# EAGLE design LightWand_USB_power (EAGLE 8.7.0)
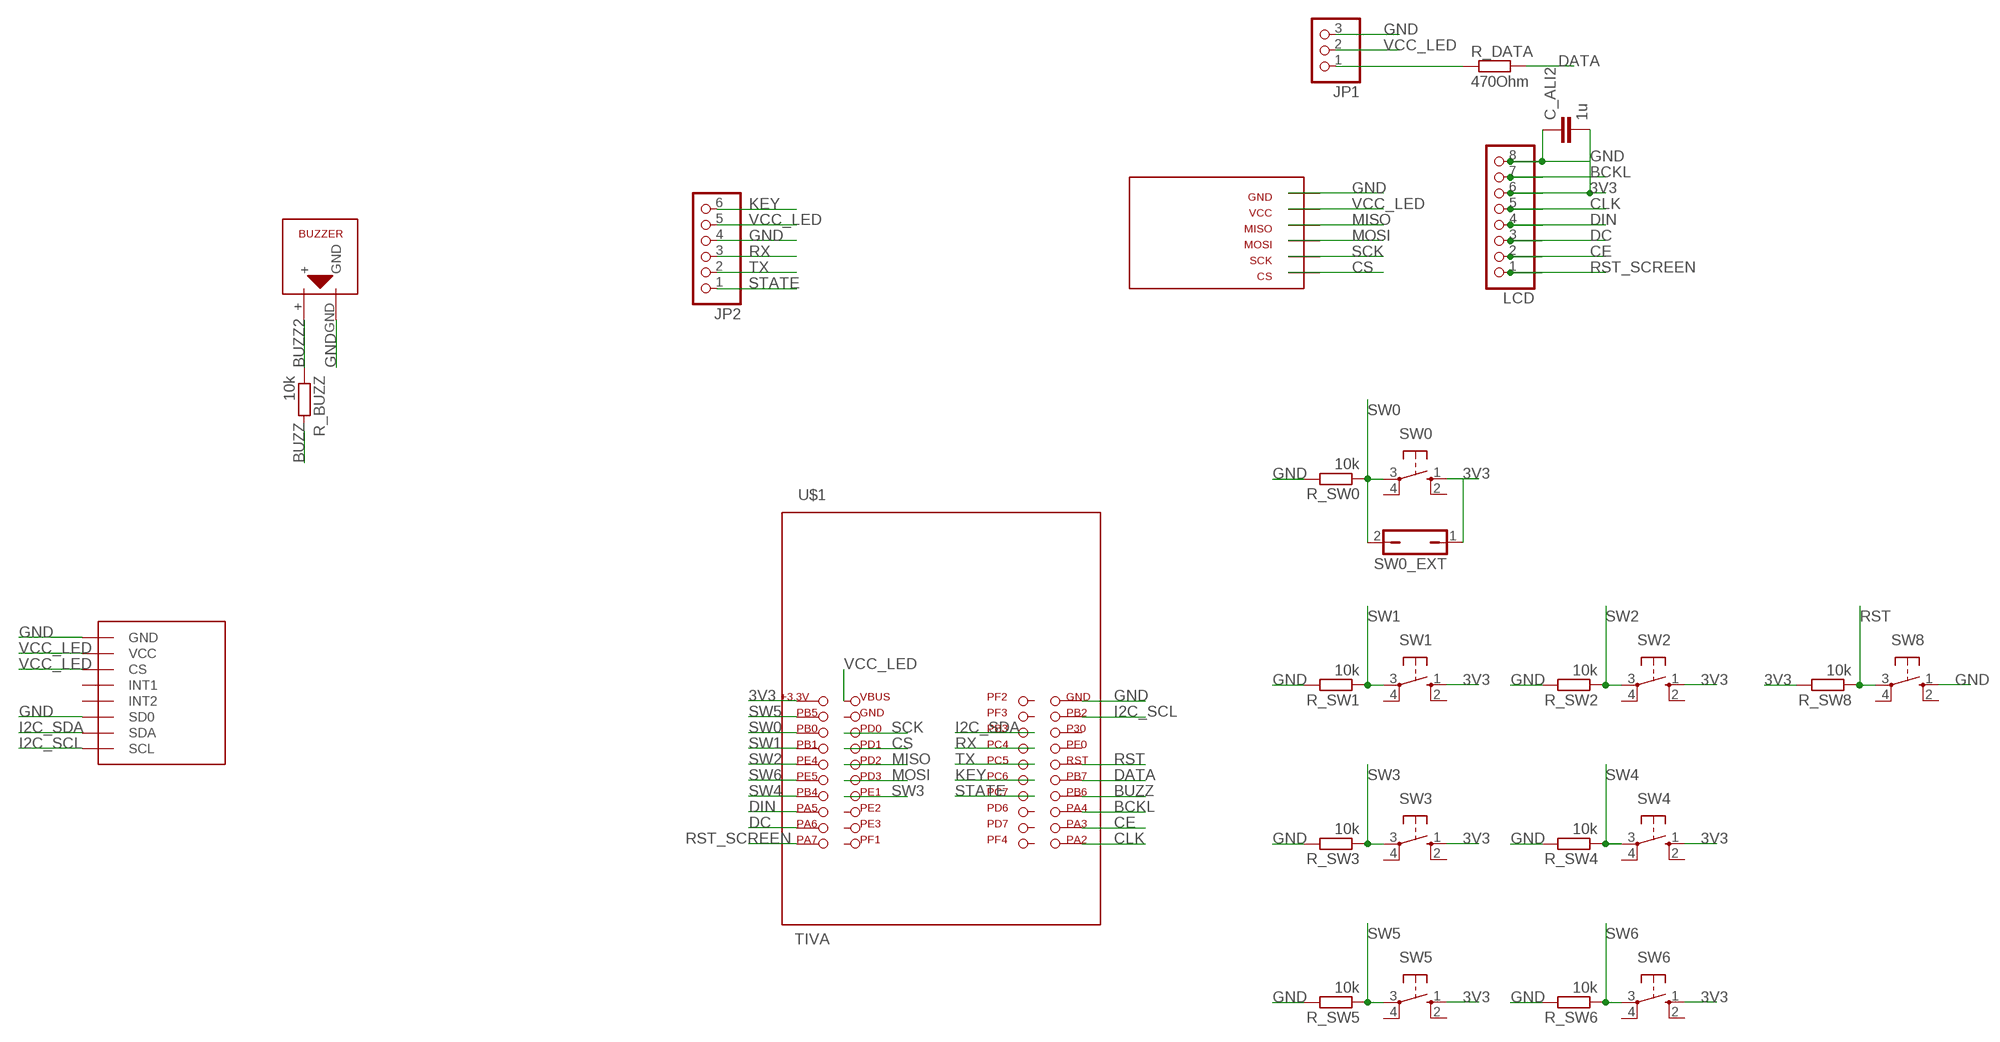
[diagram p0: schematic, sheet 1]

## Parts
C_ALI2  1u  C-EUC1206  [C1206]
JP1  PINHD-1X3  [1X03]
JP2  PINHD-1X6  [1X06]
LCD  PINHD-1X8  [1X08]
R_BUZZ  10k  R-EU_R1206  [R1206]
R_DATA  470Ohm  R-EU_R1206  [R1206]
R_SW0  10k  R-EU_R1206  [R1206]
R_SW1  10k  R-EU_R1206  [R1206]
R_SW2  10k  R-EU_R1206  [R1206]
R_SW3  10k  R-EU_R1206  [R1206]
R_SW4  10k  R-EU_R1206  [R1206]
R_SW5  10k  R-EU_R1206  [R1206]
R_SW6  10k  R-EU_R1206  [R1206]
R_SW8  10k  R-EU_R1206  [R1206]
SW0  10-XX  [B3F-10XX]
SW0_EXT  JP1Q  [JP1]
SW1  10-XX  [B3F-10XX]
SW2  10-XX  [B3F-10XX]
SW3  10-XX  [B3F-10XX]
SW4  10-XX  [B3F-10XX]
SW5  10-XX  [B3F-10XX]
SW6  10-XX  [B3F-10XX]
SW8  10-XX  [B3F-10XX]
U$1  TIVA  [TIVACSERIES]
U$2  ADXL345  [ADXL345]
U$3  MURATA_BUZZER  [MURATA_BUZZER]
U$4  SD_READER_CATALEX  [SD_READER_CATALEX]

## Nets
3V3: C_ALI2.2 LCD.6 R_SW8.2 SW0.1(S) SW0_EXT.1 SW1.1(S) SW2.1(S) SW3.1(S) SW4.1(S) SW5.1(S) SW6.1(S) U$1.+3.3V(3.3V)
BCKL: LCD.7 U$1.PA4
BUZZ: R_BUZZ.2 U$1.PB6
BUZZ2: R_BUZZ.1 U$3.+
CE: LCD.2 U$1.PA3
CLK: LCD.5 U$1.PA2
CS: U$1.PD1 U$4.CS
DATA: R_DATA.2 U$1.PB7
DC: LCD.3 U$1.PA6
DIN: LCD.4 U$1.PA5
GND [GND]: C_ALI2.1 JP1.3 JP2.4 LCD.8 R_SW0.2 R_SW1.2 R_SW2.2 R_SW3.2 R_SW4.2 R_SW5.2 R_SW6.2 SW8.1(S) U$1.GND1(GND2) U$2.P$1(GND) U$2.P$6(SD0) U$3.GND U$4.GND
I2C_SCL: U$1.PB2 U$2.P$7(SCL)
I2C_SDA: U$1.PB3 U$2.P$8(SDA)
KEY: JP2.6 U$1.PC6
MISO: U$1.PD2 U$4.MISO
MOSI: U$1.PD3 U$4.MOSI
N$3: JP1.1 R_DATA.1
RST: R_SW8.1 SW8.3(P) U$1.RST
RST_SCREEN: LCD.1 U$1.PA7
RX: JP2.3 U$1.PC4
SCK: U$1.PD0 U$4.SCK
STATE: JP2.1 U$1.PC7
SW0: R_SW0.1 SW0.3(P) SW0_EXT.2 U$1.PB0
SW1: R_SW1.1 SW1.3(P) U$1.PB1
SW2: R_SW2.1 SW2.3(P) U$1.PE4
SW3: R_SW3.1 SW3.3(P) U$1.PE1
SW4: R_SW4.1 SW4.3(P) U$1.PB4
SW5: R_SW5.1 SW5.3(P) U$1.PB5
SW6: R_SW6.1 SW6.3(P) U$1.PE5
TX: JP2.2 U$1.PC5
VCC_LED [VCC]: JP1.2 JP2.5 U$1.VBUS U$2.P$2(VCC) U$2.P$3(CS) U$4.VCC
Unconnected: SW0.2(S1) SW0.4(P1) SW1.2(S1) SW1.4(P1) SW2.2(S1) SW2.4(P1) SW3.2(S1) SW3.4(P1) SW4.2(S1) SW4.4(P1) SW5.2(S1) SW5.4(P1) SW6.2(S1) SW6.4(P1) SW8.2(S1) SW8.4(P1) U$1.GND U$1.P30 U$1.PD6 U$1.PD7 U$1.PE2 U$1.PE3 U$1.PF0 U$1.PF1 U$1.PF2 U$1.PF3 U$1.PF4 U$2.P$4(INT1) U$2.P$5(INT2)

## Library data of the parts
C_ALI2 = resistor:C-EU: CAPACITOR, European symbol
JP1 = adafruit:PINHD-1X3: PIN HEADER
JP2 = adafruit:PINHD-1X6: PIN HEADER
LCD = pinhead:PINHD-1X8: PIN HEADER
R_BUZZ R_DATA R_SW0 R_SW1-R_SW6 R_SW8 = resistor:R-EU_: RESISTOR, European symbol
SW0 SW1-SW6 SW8 = switch-omron:10-XX: OMRON SWITCH; MPN: B3F-1000; OC_FARNELL: 176432; OC_NEWARK: 36M3542
SW0_EXT = jumper:JP1Q: JUMPER
U$1 = aetel:TIVA
U$2 = aetel:ADXL345: SPI/I2C accelerometer
U$3 = aetel:MURATA_BUZZER: Murata SMD buzzer model PKLCS1212E4001-R1
U$4 = aetel:SD_READER_CATALEX

## Net classes
1 GND: width 1.016 mm
2 VCC: width 0.889 mm
3 VCC_LED: width 0.889 mm
4 VIN: width 1.016 mm

## Board
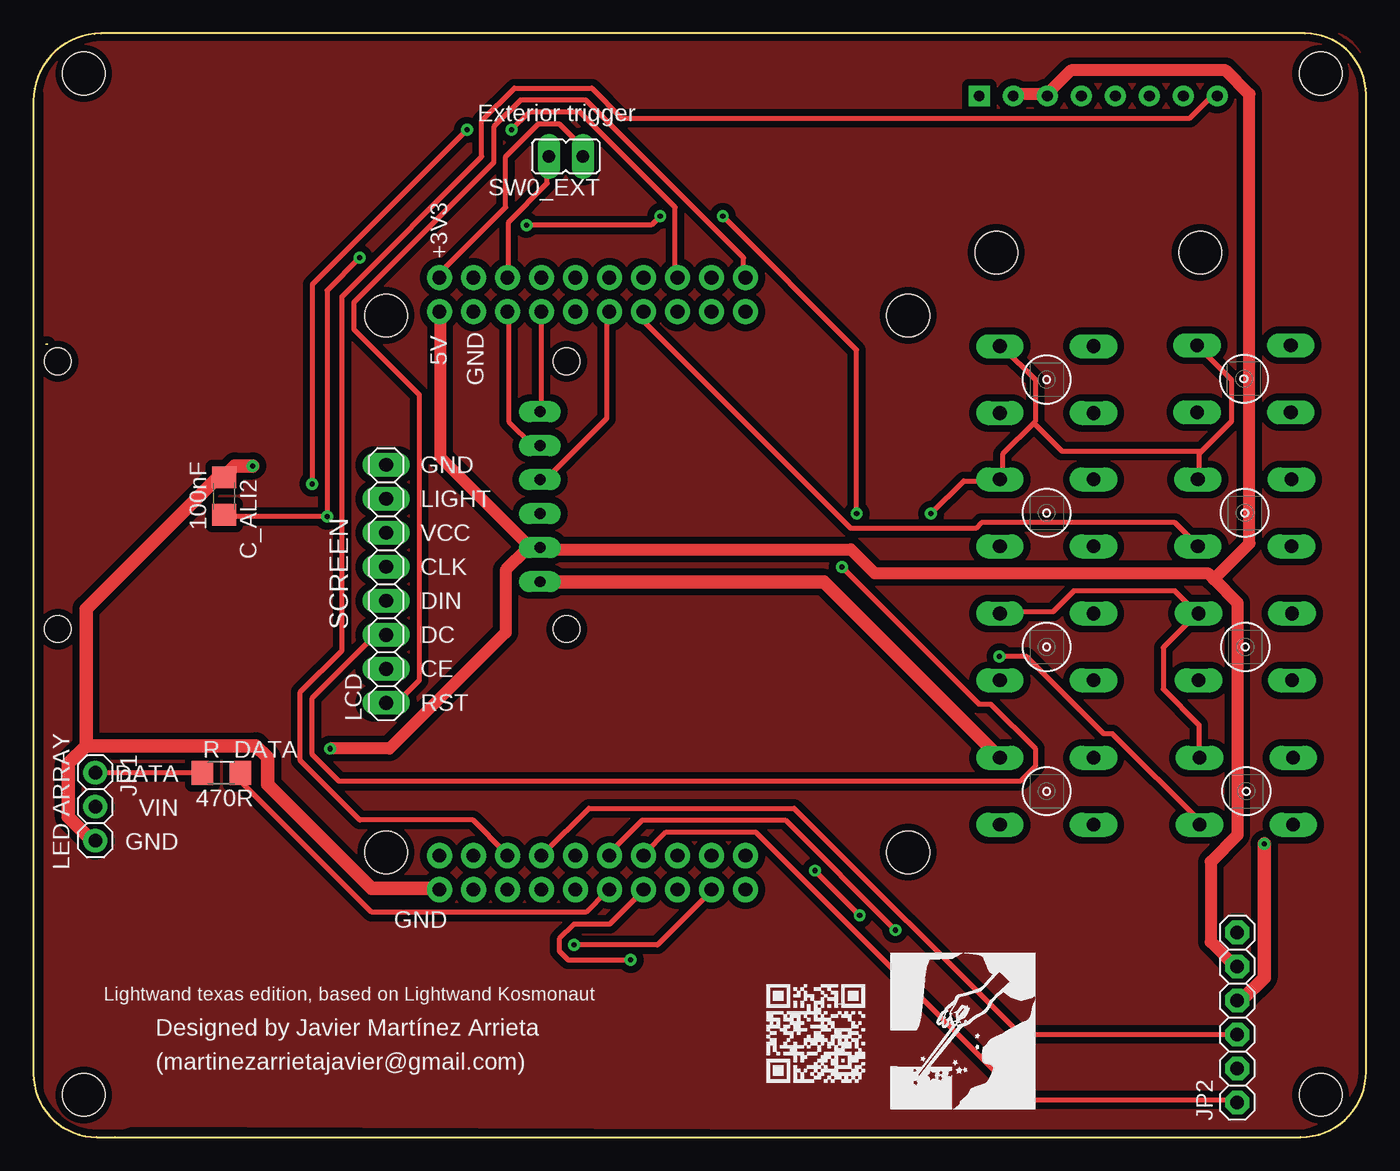
[diagram p1: board, top side]
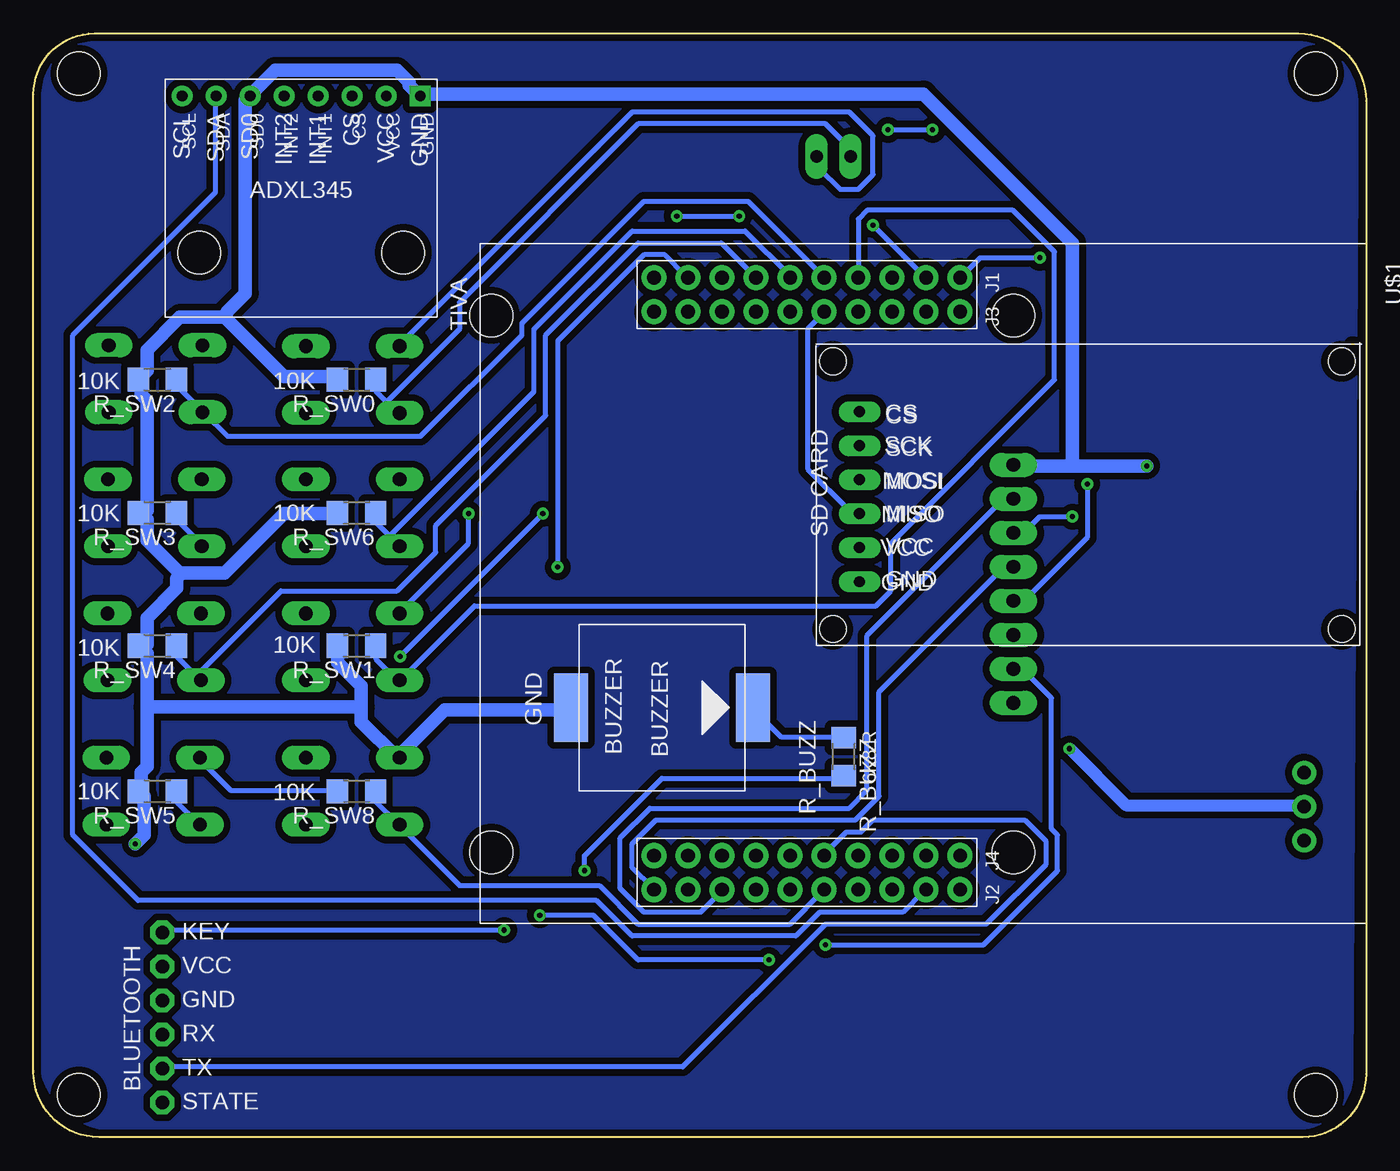
[diagram p2: board, bottom side, seen from below]

Size 99.54 x 82.45 mm. Coordinates in mm from the lower left corner, seen from the top.
Outline: 5.03,82.45 arc90 0,77.42 0,66.75 0,4.72 arc90 4.72,0 6.07,0 94.67,0 arc90 99.54,4.88 99.54,4.98 99.54,77.9 arc90 95,82.45 5.03,82.45
Copper layers (1*16): Top 0.035mm / dielectric 1.5mm / Bottom 0.035mm
Design rules "china": minimum track width 15mil, minimum drill 15mil, track to track 20mil, track to pad 20mil, pad to pad 20mil, via to via 15mil, smd to smd 8mil, copper to edge 20mil, drill to drill 8mil, minimum pad ring 15mil, minimum via ring 10mil, stop-mask expansion 4mil, vias tented up to drill 0mil, thermal gap 10mil
Holes 3.2 mm at 26.34,21.27 26.34,61.38 65.34,61.38 65.34,21.27 3.75,79.46 3.75,3.15 96.15,79.46 96.15,3.15

### Footprints (pad centres in the part's own frame; a part is rotated, then mirrored left to right if it is on the bottom)
C1206 = smd 1.6 x 1.8: 1 -1.4,0; 2 1.4,0
1X03 = drill 1.016: 1 -2.54,0; 2 0,0; 3 2.54,0
1X06 = drill 1.016 octagon: 1 -6.35,0; 2 -3.81,0; 3 -1.27,0; 4 1.27,0; 5 3.81,0; 6 6.35,0
1X08 = drill 1.016 long: 1 -8.89,0; 2 -6.35,0; 3 -3.81,0; 4 -1.27,0; 5 1.27,0; 6 3.81,0; 7 6.35,0; 8 8.89,0
R1206 = smd 1.6 x 1.803: 1 -1.422,0; 2 1.422,0
B3F-10XX = drill 1.016 long: 1 -3.5,2.5; 2 3.5,2.5; 3 -3.5,-2.5; 4 3.5,-2.5
JP1 = drill 0.914 long: 1 0,-1.27; 2 0,1.27
TIVACSERIES = drill 1.016 pad 1.88: +3.3V -22.86,11.43; GND -20.32,8.89; GND1 22.86,11.43; P30 22.86,6.35; PA2 22.86,-11.43; PA3 22.86,-8.89; PA4 22.86,-6.35; PA5 -22.86,-6.35; PA6 -22.86,-8.89; PA7 -22.86,-11.43; PB0 -22.86,6.35; PB1 -22.86,3.81; PB2 22.86,8.89; PB3 20.32,6.35; PB4 -22.86,-3.81; PB5 -22.86,8.89; PB6 22.86,-3.81; PB7 22.86,-1.27; PC4 20.32,3.81; PC5 20.32,1.27; PC6 20.32,-1.27; PC7 20.32,-3.81; PD0 -20.32,6.35; PD1 -20.32,3.81; PD2 -20.32,1.27; PD3 -20.32,-1.27; PD6 20.32,-6.35; PD7 20.32,-8.89; PE1 -20.32,-3.81; PE2 -20.32,-6.35; PE3 -20.32,-8.89; PE4 -22.86,1.27; PE5 -22.86,-1.27; PF0 22.86,3.81; PF1 -20.32,-11.43; PF2 20.32,11.43; PF3 20.32,8.89; PF4 20.32,-11.43; RST 22.86,1.27; VBUS -20.32,11.43
ADXL345 = drill 0.8 square: P$1 -7.62,8.89 | drill 0.8: P$2 -7.62,6.35; P$3 -7.62,3.81; P$4 -7.62,1.27; P$5 -7.62,-1.27; P$6 -7.62,-3.81; P$7 -7.62,-6.35; P$8 -7.62,-8.89 | hole 3.2: 4.08,7.62; 4.08,-7.62
MURATA_BUZZER = smd 5.08 x 2.54: + 0,-6.8; GND 0,6.8
SD_READER_CATALEX = drill 0.8 long: CS -7.187,6.322; GND -7.187,-6.378; MISO -7.187,-1.298; MOSI -7.187,1.242; SCK -7.187,3.782; VCC -7.187,-3.838 | hole 2: -9.187,10.077; -9.187,-9.93; 28.826,10.077; 28.826,-9.93

### Placement (x,y rotation side)
C_ALI2  14.25,47.9 270 top
JP1  4.62,24.69 270 top
JP2  89.92,8.94 90 top
LCD  26.34,41.33 90 top
R_BUZZ  39.01,28.42 270 bottom
R_DATA  14.05,27.21 0 top
R_SW0  75.41,56.59 180 bottom
R_SW1  75.41,36.71 180 bottom
R_SW2  90.29,56.59 180 bottom
R_SW3  90.29,46.63 180 bottom
R_SW4  90.29,36.71 180 bottom
R_SW5  90.29,25.84 180 bottom
R_SW6  75.41,46.63 180 bottom
R_SW8  75.41,25.84 180 bottom
SW0  75.69,56.59 0 top
SW0_EXT  39.77,73.26 90 top
SW1  75.69,36.62 0 top
SW2  90.42,56.65 0 top
SW3  90.48,46.63 0 top
SW4  90.53,36.62 0 top
SW5  90.6,25.84 0 top
SW6  75.69,46.63 0 top
SW8  75.69,25.84 0 top
U$1  41.76,41.35 270 bottom
U$2  79.54,70.16 270 bottom
U$3  52.6,32.08 90 bottom
U$4  30.65,47.88 0 bottom

### Tracks (layer width: path | path; a pad name or v marks a point on that pad's centre or on a via)
3V3  (via drill 0.38)
  Top 0.381: 87.16,51.13 89.5,53.47 89.5,56.58 87.05,59.02 SW2.1 | 87.16,51.13 87.05,51.02 87.05,49.24 SW3.1 | 74.72,53.36 74.83,53.47 74.83,56.58 72.38,59.02 SW0.1 | 74.72,53.36 72.38,51.02 72.38,49.24 SW6.1 72.16,49.02 69.49,49.02 v67.05,46.58 | 87.16,51.13 87.05,51.24 76.83,51.24 74.83,53.24 74.72,53.36 | SW1.1 72.38,39.24 76.16,39.24 77.72,40.8 85.27,40.8 86.83,39.24 SW4.1 86.83,39.02 84.39,36.58 84.39,33.47 87.05,30.8 87.05,28.35 SW5.1 | C_ALI2.2 14.38,46.36 v21.93,46.36 21.93,63.25 v24.38,65.69 | SW0_EXT.1 40.82,73.47 40.82,74.14 39.27,75.69 37.71,75.69 35.27,73.25 35.27,69.47 30.16,64.36 U$1.+3.3V
  Bottom 0.381: R_SW8.2 77.05,25.91 84.83,25.91 87.05,28.13 SW5.1 | v67.05,46.58 67.05,44.36 72.16,39.24 SW1.1 | v21.93,46.36 24.38,46.36 25.49,45.24 26.16,45.24 LCD.6 | v24.38,65.69 28.82,65.69 30.16,64.36 U$1.+3.3V | SW0.1 72.16,59.24 54.83,76.58 38.6,76.58 36.82,74.8 36.82,71.91 37.93,70.8 39.27,70.8 40.82,72.36 40.82,73.25 SW0_EXT.1
BCKL
  Bottom 0.381: LCD.7 26.38,47.47 27.27,47.47 37.27,37.47 37.27,25.91 38.6,24.57 53.49,24.57 55.71,22.35 55.71,18.57 53.94,16.8 49.71,16.8 48.16,18.35 U$1.PA4
BUZZ  (via drill 0.38)
  Top 0.381: v61.72,16.57 v58.38,19.91 | v44.6,13.24 39.94,13.24 39.27,13.91 39.27,14.8 40.38,15.91 43.05,15.91 45.49,18.35 U$1.PB6
  Bottom 0.381: v58.38,19.91 58.38,21.02 52.6,26.8 39.05,26.8 R_BUZZ.2 | v61.72,16.57 57.72,16.57 54.38,13.24 v44.6,13.24
BUZZ2
  Bottom 0.381: R_BUZZ.1 39.05,29.91 43.71,29.91 45.71,31.91 U$3.+
CE  (via drill 0.38)
  Top 0.381: v40.38,14.35 46.6,14.35 50.6,18.35 U$1.PA3
  Bottom 0.381: v40.38,14.35 28.6,14.35 23.04,19.91 23.04,22.57 23.49,23.02 23.49,32.8 25.49,34.8 26.16,34.8 LCD.2
CLK
  Bottom 0.381: LCD.5 26.38,42.58 27.04,42.58 36.38,33.24 36.38,25.46 38.16,23.69 53.05,23.69 54.83,21.91 54.83,20.13 53.27,18.57 U$1.PA2
CS
  Top 0.381: U$4.CS 37.93,54.36 37.93,61.47 U$1.PD1
DATA
  Top 0.381: R_DATA.2 15.49,27.02 15.49,26.57 25.27,16.8 41.27,16.8 42.82,18.35 U$1.PB7
DC  (via drill 0.38)
  Top 0.381: v60.38,42.58 70.61,32.35 71.49,32.35 74.83,29.02 74.83,27.69 73.72,26.57 22.82,26.57 20.82,28.57 20.82,32.8 25.49,37.47 26.16,37.47 LCD.3
  Bottom 0.381: v60.38,42.58 60.38,59.47 53.94,65.91 52.38,65.91 50.83,64.36 U$1.PA6
DIN  (via drill 0.38)
  Top 0.381: v20.82,48.8 20.82,63.69 v32.38,75.25 | v35.71,75.25 37.05,76.58 40.82,76.58 47.94,69.47 47.94,64.36 U$1.PA5
  Bottom 0.381: v20.82,48.8 20.82,44.8 25.49,40.13 26.16,40.13 LCD.4 | v35.71,75.25 v32.38,75.25
GND  (via drill 0.38)
  Top 1.016: 3.93,29.24 3.93,39.47 13.71,49.24 14.15,49.24 C_ALI2.1 14.6,49.69 15.04,50.13 v16.38,50.13 | 3.93,29.24 2.6,27.91 2.6,23.91 4.15,22.35 4.6,22.35 JP1.3 | U$1.GND1 30.16,18.57 25.27,18.57 17.49,26.35 17.49,28.35 16.6,29.24 4.38,29.24 3.93,29.24 | U$4.GND 37.93,41.47 59.05,41.47 72.16,28.35 SW8.1 | v91.94,21.91 91.94,11.91 90.39,10.35 89.94,10.35 JP2.4
  Bottom 1.016: v16.38,50.13 21.93,50.13 | 21.93,50.13 26.16,50.13 LCD.8 | 75.05,32.13 75.05,31.02 72.38,28.35 SW8.1 71.94,28.8 68.83,31.91 59.49,31.91 U$3.GND | 75.05,32.13 75.05,33.69 76.83,35.47 76.83,36.58 R_SW1.2 | 85.27,61.25 80.83,56.8 77.05,56.8 R_SW0.2 | 85.27,61.25 88.61,61.25 91.05,58.8 91.05,57.24 91.5,56.8 R_SW2.2 91.5,56.13 91.5,55.47 91.05,55.02 91.05,46.8 R_SW3.2 91.5,46.58 91.05,46.13 91.05,44.58 88.61,42.13 | 85.27,61.25 85.05,61.69 83.72,63.02 83.72,77.47 U$2.P$6 83.27,77.91 81.5,79.69 72.38,79.69 71.49,78.8 71.49,78.58 70.83,77.91 U$2.P$1 70.16,77.91 33.05,77.91 21.93,66.8 21.93,50.58 21.93,50.13 | 88.61,42.13 85.27,42.13 80.83,46.58 77.05,46.58 R_SW6.2 | 91.05,32.13 91.05,36.13 91.5,36.58 R_SW4.2 91.05,36.8 91.05,38.8 88.83,41.02 88.83,41.69 88.61,42.13 | 91.05,32.13 91.05,27.69 91.5,27.24 91.5,25.91 R_SW5.2 91.28,25.46 91.28,22.57 v91.94,21.91 | 75.05,32.13 75.5,32.13 90.61,32.13 91.05,32.13
I2C_SCL
  Bottom 0.381: U$2.P$7 85.94,77.69 85.94,70.58 96.61,59.91 96.61,22.57 91.72,17.69 57.49,17.69 54.83,15.02 42.6,15.02 40.82,16.8 34.6,16.8 33.05,18.35 U$1.PB2
I2C_SDA
  Top 0.381: U$2.P$8 88.39,77.69 87.94,77.69 86.39,76.14 43.94,76.14 41.71,78.36 35.93,78.36 33.49,75.91 33.49,73.25 23.04,62.8 23.04,36.35 19.93,33.24 19.93,28.13 24.38,23.69 32.82,23.69 35.27,21.24 U$1.PB3
KEY  (via drill 0.38)
  Top 0.381: v64.38,15.46 56.16,23.69 45.49,23.69 43.05,21.24 U$1.PC6
  Bottom 0.381: v64.38,15.46 89.72,15.46 JP2.6
MISO
  Bottom 0.381: U$4.MISO 37.93,46.8 38.6,46.8 41.71,49.91 41.71,60.36 40.6,61.47 U$1.PD2
MOSI
  Top 0.381: U$4.MOSI 37.93,49.24 38.38,49.24 42.82,53.69 42.82,61.47 U$1.PD3
N$1
  pour Bottom: 1.02,4.32 arc90 5.87,0.58 93.68,0.45 arc90 99.19,7.01 99.31,79.2 arc90 95.78,82.31 5.16,82.46 arc90 0.61,78.82
N$2
  pour Top: 4.6,82.42 arc90 0.79,77.88 0.79,3.48 arc90 7.29,0.86 93.75,0.48 arc90 99.24,6.5 99.34,80.52 arc90 95.1,82.46 4.85,82.46
N$3
  Top 0.381: R_DATA.1 12.6,27.24 4.82,27.24 JP1.1
RST
  Bottom 0.381: R_SW8.1 73.94,25.69 73.94,25.02 72.38,23.46 SW8.3 72.16,23.24 67.72,18.8 57.27,18.8 54.38,15.91 43.05,15.91 40.6,18.35 U$1.RST
RST_SCREEN
  Top 0.381: LCD.1 26.38,32.58 27.27,32.58 28.82,34.13 28.82,55.47 23.93,60.36 23.93,62.36 34.38,72.8 34.38,75.47 36.38,77.47 41.27,77.47 53.05,65.69 53.05,64.36 U$1.PA7
RX
  Top 0.381: JP2.3 89.72,7.68 73.72,7.68 56.83,24.57 41.49,24.57 38.16,21.24 U$1.PC4
SCK
  Top 0.381: U$4.SCK 37.71,51.69 37.27,51.69 35.49,53.47 35.49,61.47 U$1.PD0
STATE
  Top 0.381: JP2.1 89.72,2.79 73.94,2.79 53.94,22.8 47.27,22.8 45.71,21.24 U$1.PC7
SW0
  Top 0.381: SW0_EXT.2 38.38,73.25 38.38,71.25 35.49,68.36 35.49,64.36 U$1.PB0
  Bottom 0.381: 73.16,54.91 72.38,54.13 SW0.3 | 73.16,54.91 73.94,55.69 73.94,56.58 R_SW0.1 | 73.16,54.91 73.05,55.02 67.72,60.36 67.72,62.36 54.38,75.69 40.38,75.69 38.6,73.91 38.6,73.47 SW0_EXT.2
SW1
  Bottom 0.381: R_SW1.1 73.94,36.58 73.94,35.69 72.38,34.13 SW1.3 72.16,34.13 66.61,39.69 36.6,39.69 35.49,40.8 35.49,44.36 23.27,56.58 23.27,66.13 26.38,69.25 37.27,69.25 37.93,68.58 37.93,64.36 U$1.PB1
SW2
  Bottom 0.381: R_SW2.1 88.83,56.58 88.83,56.13 87.05,54.36 SW2.3 86.83,54.13 85.05,52.36 70.61,52.36 63.05,59.91 63.05,60.8 53.94,69.91 46.16,69.91 40.6,64.36 U$1.PE4
SW3
  Top 0.381: U$1.PE1 45.71,61.47 45.71,60.8 61.05,45.47 70.38,45.47 70.83,45.91 85.27,45.91 86.83,44.36 SW3.3
  Bottom 0.381: R_SW3.1 88.83,46.58 88.83,46.13 87.05,44.36 SW3.3
SW4
  Bottom 0.381: R_SW4.1 88.83,36.58 88.83,35.91 87.05,34.13 SW4.3 87.27,34.58 81.05,40.8 72.38,40.8 69.49,43.69 69.49,45.69 61.27,53.91 61.27,59.91 54.38,66.8 48.16,66.8 45.71,64.36 U$1.PB4
SW5  (via drill 0.38)
  Top 0.381: v36.82,68.13 46.16,68.13 v46.82,68.8 | v51.49,68.8 61.49,58.8 v61.49,46.58 | v72.16,35.91 74.16,35.91 79.94,30.13 80.61,30.13 87.27,23.46 SW5.3
  Bottom 0.381: R_SW5.1 88.83,25.69 88.83,25.02 87.27,23.46 SW5.3 | v36.82,68.13 33.05,64.36 U$1.PB5 | v51.49,68.8 v46.82,68.8 | v72.16,35.91 v61.49,46.58
SW6
  Bottom 0.381: R_SW6.1 73.94,46.58 73.94,45.91 72.38,44.36 SW6.3 72.83,45.02 62.16,55.69 62.16,60.36 54.83,67.69 46.38,67.69 43.05,64.36 U$1.PE5
TX
  Bottom 0.381: JP2.2 89.72,5.24 51.05,5.24 40.38,15.91 28.38,15.91 23.93,20.35 23.93,22.13 25.49,23.69 36.82,23.69 37.71,22.8 38.82,22.8 40.38,21.24 U$1.PC5
VCC_LED  (via drill 0.38)
  Top 0.889: U$2.P$2 73.27,77.91 75.72,77.91 U$2.P$3 75.94,78.14 77.5,79.69 89.05,79.69 90.83,77.91 90.83,44.36 88.39,41.91 88.16,41.69 | U$4.VCC 37.71,44.13 37.05,44.13 30.38,50.8 30.38,61.47 U$1.VBUS | 88.16,41.69 87.72,42.13 62.83,42.13 61.05,43.91 38.16,43.91 U$4.VCC | 88.16,41.69 89.94,39.91 89.94,22.57 87.94,20.57 87.94,14.57 89.72,12.8 JP2.5 | v22.16,29.02 26.6,29.02 35.27,37.69 35.27,42.36 36.82,43.91 U$4.VCC
  Bottom 0.889: v22.16,29.02 17.93,24.8 4.82,24.8 JP1.2

### Text on the board
tSilk: Exterior trigger | +3V3 | 5V | GND | 100nF | GND / LIGHT / VCC / CLK / DIN / DC / CE / RST | SCREEN | 470R | DATA / VIN / GND | LED ARRAY | GND | Lightwand texas edition, based on Lightwand Kosmonaut | Designed by Javier Martínez Arrieta / (martinezarrietajavier@gmail.com) | C:/Users/Javier/Downloads/Telegram Desktop/texanwand.BMP
_bsilk: SCL / SDA / SD0 / INT2 / INT1 / CS / VCC / GND | ADXL345 | 10K | 10K | CS / SCK / MOSI / MISO / VCC / GND | 10K | 10K | SD CARD | 10K | 10K | R_BUZZ | 6K8 R | GND | BUZZER | 10K | 10K | KEY / VCC / GND / RX / TX / STATE | BLUETOOTH